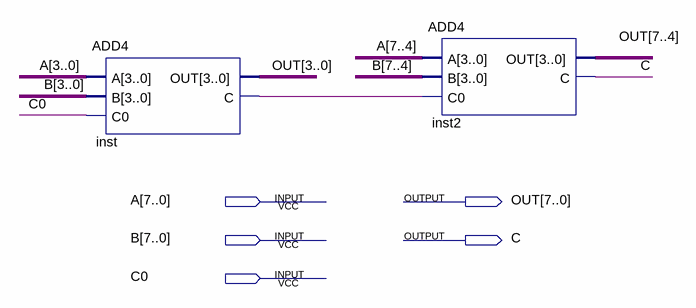
[diagram p0: schematic sheet]
// Quartus schematic ADD8.bdf as structural Verilog: 2 symbols, 5 pins
module ADD8 (
  input  [7:0] A,
  input  [7:0] B,
  input  C0,
  output [7:0] OUT,
  output C
);

  wire inst_c;

  ADD4 inst (.A(A[3:0]), .B(B[3:0]), .C0(C0), .OUT(OUT[3:0]), .C(inst_c));
  ADD4 inst2 (.A(A[7:4]), .B(B[7:4]), .C0(inst_c), .OUT(OUT[7:4]), .C(C));
endmodule
